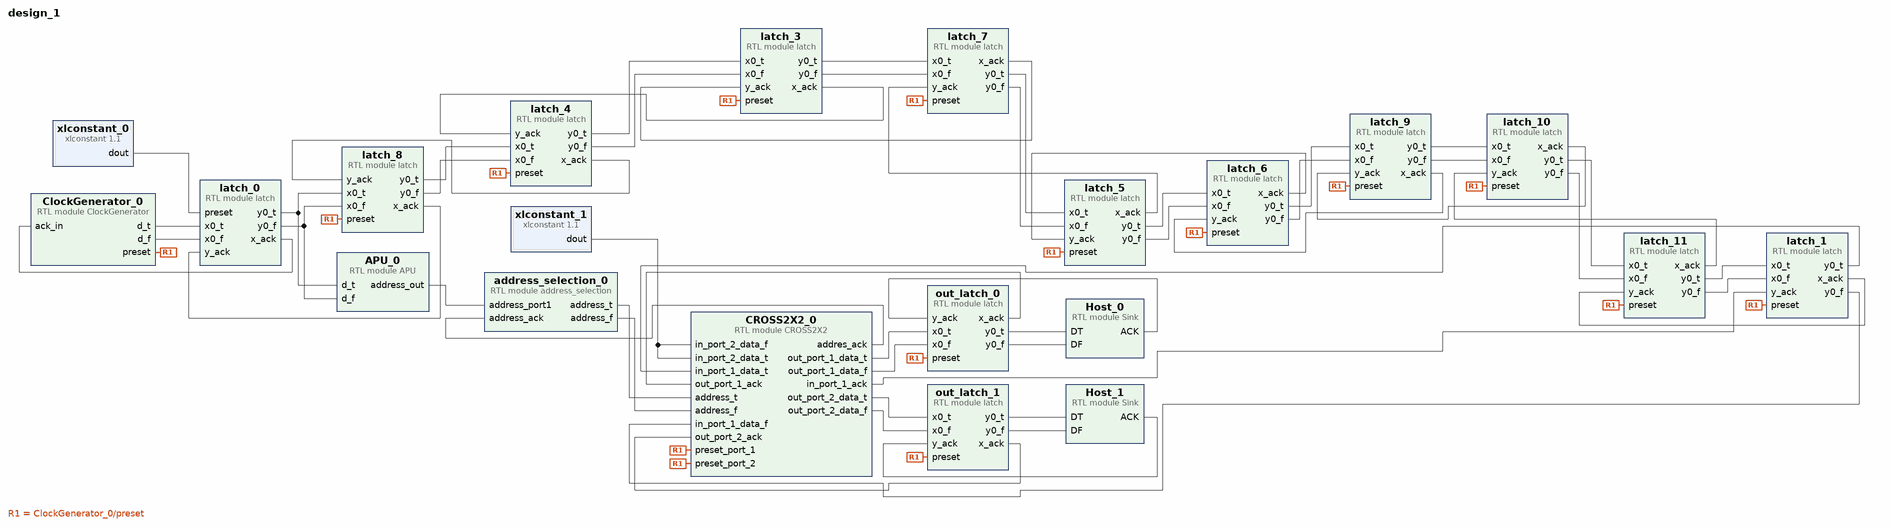
[diagram p0: block diagram of the top level]
# Vivado block design design_1, xc7a35tcpg236-1, Vivado 2019.2
create_bd_design design_1

create_bd_cell -type ip -vlnv xilinx.com:ip:xlconstant:1.1 xlconstant_0
set_property -dict {CONFIG.CONST_VAL 0} [get_bd_cells xlconstant_0]
create_bd_cell -type ip -vlnv xilinx.com:ip:xlconstant:1.1 xlconstant_1
set_property -dict {CONFIG.CONST_VAL 0} [get_bd_cells xlconstant_1]
create_bd_cell -type module -reference Sink Host_0
create_bd_cell -type module -reference latch latch_0
create_bd_cell -type module -reference latch out_latch_0
create_bd_cell -type module -reference latch latch_1
create_bd_cell -type module -reference latch latch_3
create_bd_cell -type module -reference latch latch_4
create_bd_cell -type module -reference latch latch_5
create_bd_cell -type module -reference latch latch_6
create_bd_cell -type module -reference latch latch_7
create_bd_cell -type module -reference latch latch_8
create_bd_cell -type module -reference latch latch_9
create_bd_cell -type module -reference latch latch_10
create_bd_cell -type module -reference latch latch_11
create_bd_cell -type module -reference ClockGenerator ClockGenerator_0
create_bd_cell -type module -reference APU APU_0
create_bd_cell -type module -reference address_selection address_selection_0
create_bd_cell -type module -reference latch out_latch_1
create_bd_cell -type module -reference Sink Host_1
create_bd_cell -type module -reference CROSS2X2 CROSS2X2_0

# ---- connections ----

connect_bd_net [get_bd_pins ClockGenerator_0/d_t] [get_bd_pins latch_0/x0_t]
connect_bd_net [get_bd_pins ClockGenerator_0/d_f] [get_bd_pins latch_0/x0_f]
connect_bd_net [get_bd_pins latch_0/x_ack] [get_bd_pins ClockGenerator_0/ack_in]
connect_bd_net -net latch_2_y0_t [get_bd_pins out_latch_0/y0_t] [get_bd_pins Host_0/DT]
connect_bd_net -net latch_2_y0_f [get_bd_pins out_latch_0/y0_f] [get_bd_pins Host_0/DF]
connect_bd_net -net Sink_0_ACK [get_bd_pins Host_0/ACK] [get_bd_pins out_latch_0/y_ack]
connect_bd_net [get_bd_pins CROSS2X2_0/out_port_1_data_t] [get_bd_pins out_latch_0/x0_t]
connect_bd_net [get_bd_pins CROSS2X2_0/out_port_1_data_f] [get_bd_pins out_latch_0/x0_f]
connect_bd_net -net APU_0_address_t [get_bd_pins address_selection_0/address_t] [get_bd_pins CROSS2X2_0/address_t]
connect_bd_net -net APU_0_address_f [get_bd_pins address_selection_0/address_f] [get_bd_pins CROSS2X2_0/address_f]
connect_bd_net [get_bd_pins CROSS2X2_0/addres_ack] [get_bd_pins address_selection_0/address_ack]
connect_bd_net [get_bd_pins xlconstant_1/dout] [get_bd_pins CROSS2X2_0/in_port_2_data_t] [get_bd_pins CROSS2X2_0/in_port_2_data_f]
connect_bd_net [get_bd_pins ClockGenerator_0/preset] \
  [get_bd_pins out_latch_0/preset] [get_bd_pins latch_1/preset] [get_bd_pins latch_8/preset] [get_bd_pins latch_4/preset] \
  [get_bd_pins latch_3/preset] [get_bd_pins latch_7/preset] [get_bd_pins latch_5/preset] [get_bd_pins latch_6/preset] \
  [get_bd_pins latch_9/preset] [get_bd_pins latch_10/preset] [get_bd_pins latch_11/preset] [get_bd_pins out_latch_1/preset] \
  [get_bd_pins CROSS2X2_0/preset_port_1] [get_bd_pins CROSS2X2_0/preset_port_2]
connect_bd_net [get_bd_pins CROSS2X2_0/in_port_1_ack] [get_bd_pins latch_1/y_ack]
connect_bd_net [get_bd_pins latch_1/y0_t] [get_bd_pins CROSS2X2_0/in_port_1_data_t]
connect_bd_net [get_bd_pins latch_1/y0_f] [get_bd_pins CROSS2X2_0/in_port_1_data_f]
connect_bd_net [get_bd_pins xlconstant_0/dout] [get_bd_pins latch_0/preset]
connect_bd_net [get_bd_pins latch_0/y0_t] [get_bd_pins latch_8/x0_t] [get_bd_pins APU_0/d_t]
connect_bd_net [get_bd_pins latch_0/y0_f] [get_bd_pins latch_8/x0_f] [get_bd_pins APU_0/d_f]
connect_bd_net [get_bd_pins latch_8/y0_t] [get_bd_pins latch_4/x0_t]
connect_bd_net [get_bd_pins latch_8/y0_f] [get_bd_pins latch_4/x0_f]
connect_bd_net [get_bd_pins latch_4/y0_t] [get_bd_pins latch_3/x0_t]
connect_bd_net [get_bd_pins latch_4/y0_f] [get_bd_pins latch_3/x0_f]
connect_bd_net [get_bd_pins latch_3/y0_t] [get_bd_pins latch_7/x0_t]
connect_bd_net [get_bd_pins latch_3/y0_f] [get_bd_pins latch_7/x0_f]
connect_bd_net [get_bd_pins latch_7/y0_t] [get_bd_pins latch_5/x0_t]
connect_bd_net [get_bd_pins latch_7/y0_f] [get_bd_pins latch_5/x0_f]
connect_bd_net [get_bd_pins latch_5/y0_t] [get_bd_pins latch_6/x0_t]
connect_bd_net [get_bd_pins latch_5/y0_f] [get_bd_pins latch_6/x0_f]
connect_bd_net [get_bd_pins latch_6/x_ack] [get_bd_pins latch_5/y_ack]
connect_bd_net [get_bd_pins latch_5/x_ack] [get_bd_pins latch_7/y_ack]
connect_bd_net [get_bd_pins latch_7/x_ack] [get_bd_pins latch_3/y_ack]
connect_bd_net [get_bd_pins latch_3/x_ack] [get_bd_pins latch_4/y_ack]
connect_bd_net [get_bd_pins latch_4/x_ack] [get_bd_pins latch_8/y_ack]
connect_bd_net [get_bd_pins latch_8/x_ack] [get_bd_pins latch_0/y_ack]
connect_bd_net [get_bd_pins latch_6/y0_t] [get_bd_pins latch_9/x0_t]
connect_bd_net [get_bd_pins latch_6/y0_f] [get_bd_pins latch_9/x0_f]
connect_bd_net [get_bd_pins latch_9/x_ack] [get_bd_pins latch_6/y_ack]
connect_bd_net [get_bd_pins latch_9/y0_t] [get_bd_pins latch_10/x0_t]
connect_bd_net [get_bd_pins latch_9/y0_f] [get_bd_pins latch_10/x0_f]
connect_bd_net [get_bd_pins latch_10/x_ack] [get_bd_pins latch_9/y_ack]
connect_bd_net [get_bd_pins latch_10/y0_t] [get_bd_pins latch_11/x0_t]
connect_bd_net [get_bd_pins latch_10/y0_f] [get_bd_pins latch_11/x0_f]
connect_bd_net [get_bd_pins latch_11/x_ack] [get_bd_pins latch_10/y_ack]
connect_bd_net [get_bd_pins latch_11/y0_t] [get_bd_pins latch_1/x0_t]
connect_bd_net [get_bd_pins latch_11/y0_f] [get_bd_pins latch_1/x0_f]
connect_bd_net [get_bd_pins latch_1/x_ack] [get_bd_pins latch_11/y_ack]
connect_bd_net [get_bd_pins APU_0/address_out] [get_bd_pins address_selection_0/address_port1]
connect_bd_net -net latch_12_y0_t [get_bd_pins out_latch_1/y0_t] [get_bd_pins Host_1/DT]
connect_bd_net -net latch_12_y0_f [get_bd_pins out_latch_1/y0_f] [get_bd_pins Host_1/DF]
connect_bd_net [get_bd_pins CROSS2X2_0/out_port_2_data_t] [get_bd_pins out_latch_1/x0_t]
connect_bd_net [get_bd_pins CROSS2X2_0/out_port_2_data_f] [get_bd_pins out_latch_1/x0_f]
connect_bd_net -net latch_2_x_ack [get_bd_pins out_latch_0/x_ack] [get_bd_pins CROSS2X2_0/out_port_1_ack]
connect_bd_net -net latch_12_x_ack [get_bd_pins out_latch_1/x_ack] [get_bd_pins CROSS2X2_0/out_port_2_ack]
connect_bd_net -net Sink_1_ACK [get_bd_pins Host_1/ACK] [get_bd_pins out_latch_1/y_ack]

validate_bd_design
save_bd_design
